# Altium project CAN_to_USB_simple.PrjPcb
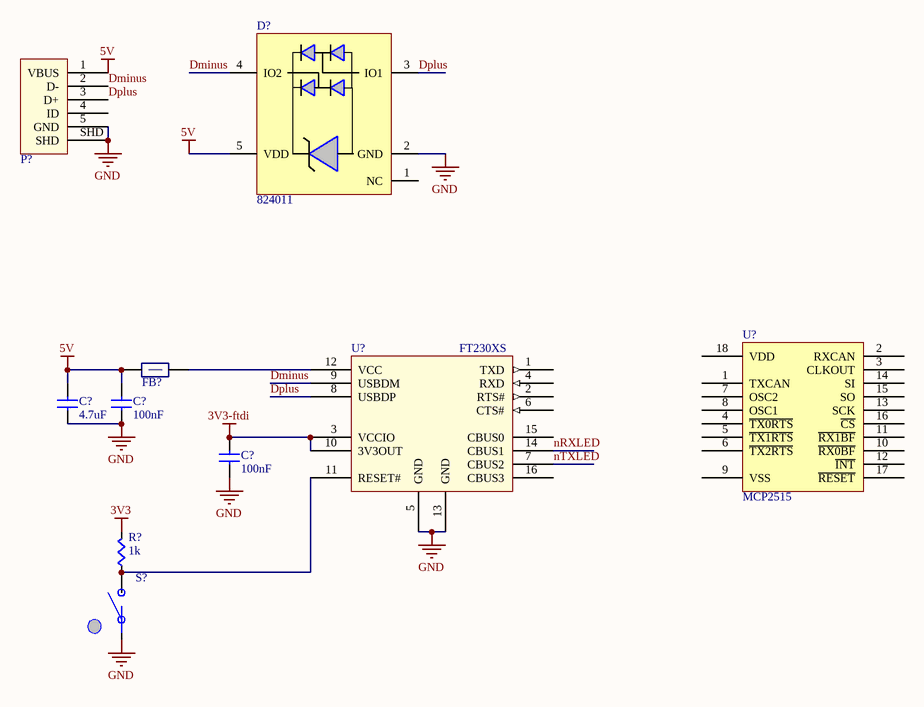
[diagram p0: USB_to_CAN.SchDoc]
1 sheet, 10 parts. Net scope: global (net labels, ports and power ports of the same name join across sheets).
Board file: USB_to_CAN.PcbDoc

## Sheet USB_to_CAN.SchDoc
size A

### Parts
(Parts that share a designator on the sheet are numbered #1, #2 ... from top to bottom, then left to right.)
C?#1  value 4.7uF  [CAPC0603]  (hidden comment: Cap)
C?#2  value 100nF  [CAPC0603]  (hidden comment: Cap)
C?#3  value 100nF  [CAPC0603]  (hidden comment: Cap)
D?  824011  [SOT95P280X116-5N]
FB?  FBead  [RES0603]  (value not drawn)
P?  UX60SC-MB-5ST  [UX60SC-MB-5ST]  (value not drawn)
R?  value 1k  [RES0603]  (hidden comment: Res)
S?  Button  [PTS645xxxxSMTR92]  (value not drawn)
U?#1  MCP2515  [MCP2515T-I/SO]
U?#2  FT230XS  [FT230XS]

### Nets
3V3: R?.1(A)
3V3-ftdi: C?#3.1(A) U?#2.3(VCCIO) U?#2.10(3V3OUT)
5V: C?#1.1(A) C?#2.1(A) D?.5(VDD) FB?.1(A) P?.1(VBUS)
GND: C?#1.2(B) C?#2.2(B) C?#3.2(B) D?.2(GND) P?.5(GND) P?.SHD S?.A U?#2.5(GND) U?#2.13(GND)
Dminus: D?.4(IO2) P?.2(D-) U?#2.9(USBDM)
Dplus: D?.3(IO1) P?.3(D+) U?#2.8(USBDP)
nRXLED: U?#2.14(CBUS1)
nTXLED: U?#2.7(CBUS2)
NetFB?_2: FB?.2(B) U?#2.12(VCC)
NetR?_2: R?.2(B) S?.B U?#2.11(RESET#)

Not connected (* = marked no-connect by the designer): D? 1(NC); P? 4(ID); U?#1 1(TXCAN) 2(RXCAN) 3(CLKOUT) 4(~{TX0RTS}) 5(~{TX1RTS}) 6(~{TX2RTS}) 7(OSC2) 8(OSC1) 9(VSS) 10(~{RX0BF}) 11(~{RX1BF}) 12(~{INT}) 13(SCK) 14(SI) 15(SO) 16(~{CS}) 17(~{RESET}) 18(VDD); U?#2 1(TXD) 2(RTS#) 4(RXD) 6(CTS#) 15(CBUS0) 16(CBUS3)

### Library data of the parts
D? = 824011: USB ESD Protection Diodes
FB? = FBead: Ferrite Bead; Supplier 1: Digi-Key; Supplier Part Number 1: 445-2988-1-ND
P? = UX60SC-MB-5ST: USB Mini B Metal Shield SMT; Supplier 1: Digi-Key; Supplier Part Number 1: H11671CT-ND
S? = Button: SPST Button; Supplier 1: Digi-Key; Supplier Part Number 1: CKN9087CT-ND
U?#1 = MCP2515: IC CAN CONTROLLER W/SPI 18SOIC; Manufacturer 1: Microchip; Manufacturer Part Number 1: MCP2515T-I/SO; ComponentLink1URL: http://ww1.microchip.com/downloads/en/DeviceDoc/20001801H.pdf; ComponentLink1Description: Datasheet; ComponentLink2URL: https://www.microchip.com/wwwproducts/en/en010406; ComponentLink2Description: Website
U?#2 = FT230XS: USB To Basic UART IC; Supplier 1: Digi-Key; Supplier Part Number 1: 768-1154-5-ND
C?#1-C?#3 = Cap: Supplier 1: Digi-Key
  C?#1: Supplier Part Number 1: 311-1455-1-ND
  C?#2 C?#3: Supplier Part Number 1: 1276-1000-1-ND
R? = Res: Supplier 1: Digi-Key